# Altium project ESC30A.PrjPcb (part 2 of 3)
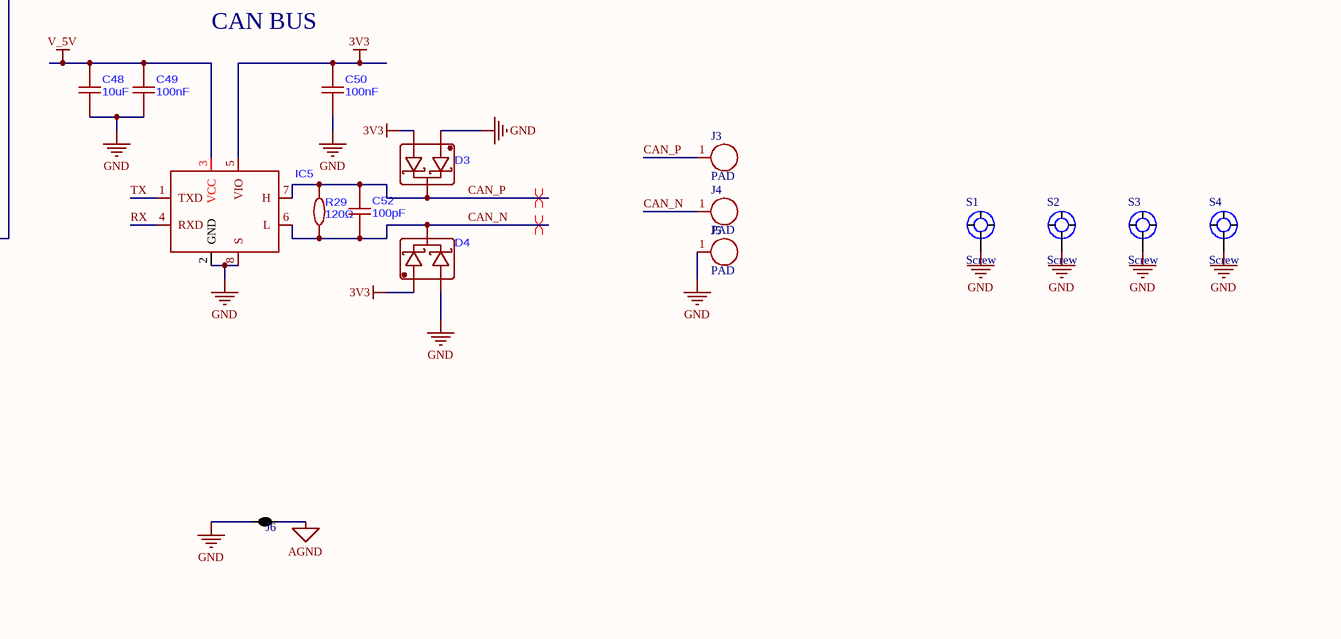
[diagram p4: ESC.SchDoc, bottom right]

## Sheet ESC.SchDoc (continued)
size A2; SheetNumber: 1; SheetTotal: 1; SPICEModelCacheXTDNQIYX: <root> / <DocumentId>XTDNQIYX</DocumentId> / <CacheFrame Number="0"> / <Model Name="smcj54a" Kind="CKT"> / <Text>*produced by Vishay General Semiconductor Taiwan / *Allen Su, 2015/12/24 / *   PSPICE / *                    anode     cathode / * Reverse direction: node 9 &lt;- node 2 / .SUBCKT smcj54a 9 2 / DF 9 90 DFMOD / .MODEL DFMOD D N = 2 IS = 1E-009 RS = 0.0184853 / + EG = 1.11 XTI = 3 / + CJO = 1.606E-009 VJ = 1.68538 M = 0.42 FC = 0.5 / + TT = 1E-008 T_MEASURED = 25 / * Leakage / RL 9 90 RLMOD 5.4E+007 / .MODEL RLMOD RES TC1 = 0 TC2 = 0 T_MEASURED = 25 / * Breakdown / RBD 90 4 1.392 / EBD 4 3 10 20 1 / DBD 3 9 DBDMOD / .MODEL DBDMOD D IS = 1E-015 N = 0.5 T_MEASURED = 25 T_ABS = 25 / IBVC 0 10 0.001 / RBVC 10 0 RBVCMOD 63150 / .MODEL RBVCMOD RES TC1 = 0 T_MEASURED = 25 / RBDX 20 23 1.392 / DBVC 23 0 DBDMOD / IBVD 0 20 0.001 / L1 90 2 1E-015 / .ENDS</Text> / </Model> / <Model Name="d_d1" Kind="MDL"> / <Text>*$ / .MODEL D_D1 D( IS=1e-15 TT=10p Rs=0.05 N=.1  VJ=10m)</Text> / </Model> / <Model Name="buf_delay_basic_gen" Kind="CKT"> / <Text>*$ / .SUBCKT BUF_DELAY_BASIC_GEN A  Y PARAMS: VDD=1 VSS=0 VTHRESH=0.5 DELAY = 10n / E_ABMGATE1    YINT1 0 VALUE {{IF(V(A) &gt; {VTHRESH} , / + {VDD},{VSS})}} / RINT YINT1 YINT2 1 / CINT YINT2 0 {DELAY*1.3} / E_ABMGATE2    YINT3 0 VALUE {{IF(V(YINT2) &gt; {VTHRESH} , / + {VDD},{VSS})}} / RINT2 YINT3 Y 1 / CINT2 Y 0 1n / .ENDS BUF_DELAY_BASIC_GEN</Text> / </Model> / <Model Name="and2_basic_gen" Kind="CKT"> / <Text>*$ / .SUBCKT AND2_BASIC_GEN A B Y PARAMS: VDD=1 VSS=0 VTHRESH=0.5 / E_ABMGATE    YINT 0 VALUE {{IF(V(A) &gt; {VTHRESH}  &amp; / + V(B) &gt; {VTHRESH},{VDD},{VSS})}} / RINT YINT Y 1 / CINT Y 0 1n / .ENDS AND2_BASIC_GEN</Text> / </Model> / <Model Name="oscillator_rt_sync_u100_h13" Kind="CKT"> / <Text>*$ / .subckt Oscillator_RT_SYNC_U100_H13 1 2 3 4 / H_U100_H13         3 4 VH_U100_H13 -1 / VH_U100_H13         1 2 0V / .ends Oscillator_RT_SYNC_U100_H13</Text> / </Model> / <Model Name="or2_basic_gen" Kind="CKT"> / <Text>*$ / .SUBCKT OR2_BASIC_GEN A B Y PARAMS: VDD=1 VSS=0 VTHRESH=0.5 / E_ABMGATE    YINT 0 VALUE {{IF(V(A) &gt; {VTHRESH}  | / + V(B) &gt; {VTHRESH},{VDD},{VSS})}} / RINT YINT Y 1 / CINT Y 0 1n / .ENDS OR2_BASIC_GEN</Text> / </Model> / <Model Name="inv_basic_gen" Kind="CKT"> / <Text>*$ / .SUBCKT INV_BASIC_GEN A  Y PARAMS: VDD=1 VSS=0 VTHRESH=0.5 / E_ABMGATE    YINT 0 VALUE {{IF(V(A) &gt; {VTHRESH} , / + {VSS},{VDD})}} / RINT YINT Y 1 / CINT Y 0 1n / .ENDS INV_BASIC_GEN</Text> / </Model> / <Model Name="oscillator_rt_sync_u100_s60" Kind="CKT"> / <Text>*$ / .subckt Oscillator_RT_SYNC_U100_S60 1 2 3 4 / S_U100_S60         3 4 1 2 _U100_S60 / RS_U100_S60         1 2 1G / .MODEL         _U100_S60 VSWITCH Roff=100e6 Ron=1u Voff=0.2 Von=0.8 / .ends Oscillator_RT_SYNC_U100_S60</Text> / </Model> / <Model Name="comp_basic_gen" Kind="CKT"> / <Text>*$ / .SUBCKT COMP_BASIC_GEN INP INM Y PARAMS: VDD=1 VSS=0 VTHRESH=0.5 / E_ABM Yint 0 VALUE {IF (V(INP) &gt; / + V(INM), {VDD},{VSS})} / R1 Yint Y 1 / C1 Y 0 1n / .ENDS COMP_BASIC_GEN</Text> / </Model> / <Model Name="d_d2" Kind="MDL"> / <Text>*$ / .MODEL D_D2 D( IS=1e-15 TT=10p Rs=0.05 N=1m  VJ=10m)</Text> / </Model> / <Model Name="comphys_basic_gen" Kind="CKT"> / <Text>*$ / .SUBCKT COMPHYS_BASIC_GEN INP INM HYS OUT PARAMS: VDD=1 VSS=0 VTHRESH=0.5 / EIN INP1 INM1 INP INM 1 / EHYS INP1 INP2 VALUE { IF( V(1) &gt; {VTHRESH},-V(HYS),0) } / EOUT OUT 0 VALUE { IF( V(INP2)&gt;V(INM1), {VDD} ,{VSS}) } / R1 OUT 1 1 / C1 1 0 1n / RINP1 INP1 0 1K / .ENDS COMPHYS_BASIC_GEN</Text> / </Model> / <Model Name="and4_basic_gen" Kind="CKT"> / <Text>*$ / .SUBCKT AND4_BASIC_GEN A B C D Y PARAMS: VDD=1 VSS=0 VTHRESH=0.5 / E_ABMGATE    YINT 0 VALUE {{IF(V(A) &gt; {VTHRESH}  &amp; / + V(B) &gt; {VTHRESH} &amp; / + V(C) &gt; {VTHRESH} &amp; / + V(D) &gt; {VTHRESH},{VDD},{VSS})}} / RINT YINT Y 1 / CINT Y 0 1n / .ENDS AND4_BASIC_GEN</Text> / </Model> / <Model Name="oscillator_rt_sync_u100_s59" Kind="CKT"> / <Text>*$ / .subckt Oscillator_RT_SYNC_U100_S59 1 2 3 4 / S_U100_S59         3 4 1 2 _U100_S59 / RS_U100_S59         1 2 1G / .MODEL         _U100_S59 VSWITCH Roff=100e6 Ron=1m Voff=0.4 Von=0.5 / .ends Oscillator_RT_SYNC_U100_S59</Text> / </Model> / <Model Name="driver_u8_s35" Kind="CKT"> / <Text>*$ / .subckt Driver_U8_S35 1 2 3 4 / S_U8_S35         3 4 1 2 _U8_S35 / RS_U8_S35         1 2 1G / .MODEL         _U8_S35 VSWITCH Roff=1000e6 Ron=15 Voff=0.2 Von=0.8 / .ends Driver_U8_S35</Text> / </Model> / <Model Name="driver_u8_s31" Kind="CKT"> / <Text>*$ / .subckt Driver_U8_S31 1 2 3 4 / S_U8_S31         3 4 1 2 _U8_S31 / RS_U8_S31         1 2 1G / .MODEL         _U8_S31 VSWITCH Roff=1000e6 Ron=155m Voff=1.0 Von=1.2 / .ends Driver_U8_S31</Text> / </Model> / <Model Name="driver_u8_s37" Kind="CKT"> / <Text>*$ / .subckt Driver_U8_S37 1 2 3 4 / S_U8_S37         3 4 1 2 _U8_S37 / RS_U8_S37         1 2 1G / .MODEL         _U8_S37 VSWITCH Roff=1e9 Ron=1m Voff=0.2V Von=0.8V / .ends Driver_U8_S37</Text> / </Model> / <Model Name="driver_u8_s5" Kind="CKT"> / <Text>*$ / .subckt Driver_U8_S5 1 2 3 4 / S_U8_S5         3 4 1 2 _U8_S5 / RS_U8_S5         1 2 1G / .MODEL         _U8_S5 VSWITCH Roff=1e9 Ron=2 Voff=0.2 Von=0.8 / .ends Driver_U8_S5</Text> / </Model> / <Model Name="d_d3" Kind="MDL"> / <Text>*$ / .MODEL D_D3 D( IS=1e-15 TT=10p Rs=0.01 N=1m  VJ=10m)</Text> / </Model> / <Model Name="driver_u8_h2" Kind="CKT"> / <Text>*$ / .subckt Driver_U8_H2 1 2 3 4 / H_U8_H2         3 4 VH_U8_H2 1 / VH_U8_H2         1 2 0V / .ends Driver_U8_H2</Text> / </Model> / <Model Name="driver_u8_s4" Kind="CKT"> / <Text>*$ / .subckt Driver_U8_S4 1 2 3 4 / S_U8_S4         3 4 1 2 _U8_S4 / RS_U8_S4         1 2 1G / .MODEL         _U8_S4 VSWITCH Roff=1e9 Ron=1.0 Voff=0.2 Von=0.8 / .ends Driver_U8_S4</Text> / </Model> / <Model Name="d_d" Kind="CKT"> / <Text>*$ / .subckt d_d 1 2 / d1 1 2 dd1 / .model dd1 d / + is=1e-015 / + tt=1e-011 / + rs=0.05 / + n=0.1 / .ends d_d</Text> / </Model> / <Model Name="or3_basic_gen" Kind="CKT"> / <Text>*$ / .SUBCKT OR3_BASIC_GEN A B C Y PARAMS: VDD=1 VSS=0 VTHRESH=0.5 / E_ABMGATE    YINT 0 VALUE {{IF(V(A) &gt; {VTHRESH}  | / + V(B) &gt; {VTHRESH} | / + V(C) &gt; {VTHRESH},{VDD},{VSS})}} / RINT YINT Y 1 / CINT Y 0 1n / .ENDS OR3_BASIC_GEN</Text> / </Model> / <Model Name="inv_delay_basic_gen" Kind="CKT"> / <Text>*$ / .SUBCKT INV_DELAY_BASIC_GEN A  Y PARAMS: VDD=1 VSS=0 VTHRESH=0.5 DELAY = 10n / E_ABMGATE1    YINT1 0 VALUE {{IF(V(A) &gt; {VTHRESH} , / + {VDD},{VSS})}} / RINT YINT1 YINT2 1 / CINT YINT2 0 {DELAY*1.3} / E_ABMGATE2    YINT3 0 VALUE {{IF(V(YINT2) &gt; {VTHRESH} , / + {VSS},{VDD})}} / RINT2 YINT3 Y 1 / CINT2 Y 0 1n / .ENDS INV_DELAY_BASIC_GEN</Text> / </Model> / <Model Name="ss2gm" Kind="CKT"> / <Text>*$ / .SUBCKT ss2gm SS GM / EPOLY GM 0 TABLE {V(SS)} = (0.5,10.9u) (0.55,12.4u) (0.6,17.5u) (0.65,23.7u) (0.7,27.1u) / + (0.75,28.5u)(.8,29.1u)(.85,29.3u) (.9,29.4u) (.95,29.6u) (1,30u) / .ENDS ss2gm</Text> / </Model> / <Model Name="erroramp_u5_s5" Kind="CKT"> / <Text>*$ / .subckt ErrorAmp_U5_S5 1 2 3 4 / S_U5_S5         3 4 1 2 _U5_S5 / RS_U5_S5         1 2 1G / .MODEL         _U5_S5 VSWITCH Roff=1e10 Ron=1m Voff=0.1 Von=0.9 / .ends ErrorAmp_U5_S5</Text> / </Model> / <Model Name="and3_basic_gen" Kind="CKT"> / <Text>*$ / .SUBCKT AND3_BASIC_GEN A B C Y PARAMS: VDD=1 VSS=0 VTHRESH=0.5 / E_ABMGATE    YINT 0 VALUE {{IF(V(A) &gt; {VTHRESH}  &amp; / + V(B) &gt; {VTHRESH} &amp; / + V(C) &gt; {VTHRESH},{VDD},{VSS})}} / RINT YINT Y 1 / CINT Y 0 1n / .ENDS AND3_BASIC_GEN</Text> / </Model> / <Model Name="buf_basic_gen" Kind="CKT"> / <Text>*$ / .SUBCKT BUF_BASIC_GEN A  Y PARAMS: VDD=1 VSS=0 VTHRESH=0.5 / E_ABMGATE    YINT 0 VALUE {{IF(V(A) &gt; {VTHRESH} , / + {VDD},{VSS})}} / RINT YINT Y 1 / CINT Y 0 1n / .ENDS BUF_BASIC_GEN</Text> / </Model> / <Model Name="srlatchrhp_basic_gen" Kind="CKT"> / <Text>*$ / .SUBCKT SRLATCHRHP_BASIC_GEN S R Q QB PARAMS: VDD=1 VSS=0 VTHRESH=0.5 / GQ 0 Qint VALUE = {IF(V(R) &gt; {VTHRESH},-5,IF(V(S)&gt;{VTHRESH},5, 0))} / CQint Qint 0 1n / RQint Qint 0 1000MEG / D_D10 Qint MY5 D_D1 / V1 MY5 0 {VDD} / D_D11 MYVSS Qint D_D1 / V2 MYVSS 0 {VSS} / EQ Qqq 0 Qint 0 1 / X3 Qqq Qqqd1 BUF_BASIC_GEN PARAMS: VDD={VDD} VSS={VSS} VTHRESH={VTHRESH} / RQq Qqqd1 Q 1 / EQb Qbr 0 VALUE = {IF( V(Q) &gt; {VTHRESH}, {VSS},{VDD})} / RQb Qbr QB 1 / Cdummy1 Q 0 1n / Cdummy2 QB 0 1n / .IC V(Qint) {VSS} / .ENDS SRLATCHRHP_BASIC_GEN</Text> / <Dependency>0\d_d1</Dependency> / <Dependency>0\buf_basic_gen</Dependency> / </Model> / <Model Name="lmr16030s_trans" Kind="CKT"> / <Text>*$ / * LMR16030 / ***************************************************************************** / * (C) Copyright 2016 Texas Instruments Incorporated. All rights reserved. / ***************************************************************************** / ** This model is designed as an aid for customers of Texas Instruments. / ** TI and its licensors and suppliers make no warranties, either expressed / ** or implied, with respect to this model, including the warranties of / ** merchantability or fitness for a particular purpose.  The model is / ** provided solely on an "as is" basis.  The entire risk as to its quality / ** and performance is with the customer / ***************************************************************************** / * / * This model is subject to change without notice. Texas Instruments / * Incorporated is not responsible for updating this model. / * / ***************************************************************************** / * / ** Released by: WEBENCH Design Center, Texas Instruments Inc. / * Part: LMR16030S / * Date: 06JUN2016 / * Model Type:  TRANSIENT / * Simulator: PSPICE / * Simulator Version: 16.2.0.p001 / * EVM Order Number: LMR16030PEVM / * EVM Users Guide: NA / * Datasheet: SNVSAH9A â€“DECEMBER 2015â€“REVISED MAY 2016 / * / * Model Version: Final 1.00 / * / ***************************************************************************** / * / * Updates: / * / * Final 1.00 / * Release to Web. / * / ***************************************************************************** / * / * Model Usage Notes: / * / * 1. All the features mentioned in the datasheet have been modelled except / *      a. Thermal behaviour / *      b. Operating quiescent current / *      c. Shutdown supply current / *      d. PLL lock in time / *      e. Sync feature works with fixed frequency external clock. If the clock frequency / *		  varies, switching frequency locks with minimum frequency of external clock. / * / ***************************************************************************** / .SUBCKT LMR16030S_TRANS BOOT EN FB GND RT/SYNC SS SW VIN PAD PARAMS: SS=0 / R_U100_R339         GND RT/SYNC  500meg / V_U100_V105         U100_N17467204 0 4.2Vdc / E_U100_ABM54         U100_N17466738 0 VALUE { / + {IF(V(U100_N17466711)&lt;0.1875,0.125*V(U100_N17466470), / + (IF(V(U100_N17466711)&lt;0.375,0.25*V(U100_N17466470), / + (IF(V(U100_N17466711)&lt;0.5625,0.5*V(U100_N17466470),V(U100_N17466470))))))} / +  } / D_U100_D78         U100_N17475790 U100_N17476944 D_D1 / E_U100_ABM51         U100_N17465902 0 VALUE { / +  if(V(U100_SYNC_DET)&gt;0.5,0,(((-V(I_RT)*1000) / + **(1/1.088))*90.52748*1u*1.015))   } / V_U100_V106         U100_N17503167 0 1 / X_U100_U725         U100_N17466245 U100_N17467423 U100_N17465899 AND2_BASIC_GEN / +  PARAMS: VDD=1 VSS=0 VTHRESH=500E-3 / X_U100_U183         SDWN U100_N17466875 U100_N17466883 OR2_BASIC_GEN PARAMS: / +  VDD=1 VSS=0 VTHRESH=500E-3 / E_U100_E56         U100_N17466711 0 FB GND 1 / X_U100_S60    U100_RAMP_CNTRL 0 U100_VRAMP 0 Oscillator_RT_SYNC_U100_S60 / X_U100_U600         RAMPIN U100_N17503167 MUXCLK COMP_BASIC_GEN PARAMS: VDD=1 / +  VSS=0 VTHRESH=0.5 / E_U100_E58         U100_N17466245 0 U100_N17475790 0 1 / X_U100_U730         U100_N17466245 U100_N17467414 INV_BASIC_GEN PARAMS: VDD=1 / +  VSS=0 VTHRESH=500E-3 / C_U100_C113         RAMPIN 0  5p IC=0 / G_U100_ABMII15         U100_N17466947 RAMPIN VALUE { V(U100_N17466738)    } / E_U100_ABM52         U100_N17465891 0 VALUE { IF(V(U100_SYNC_DET)&gt;.5,0,1)    } / X_U100_U186         U100_CLK_DET SDWN U100_RAMP_CNTRL OR2_BASIC_GEN PARAMS: / +  VDD=1 VSS=0 VTHRESH=500E-3 / V_U100_V104         U100_N17466947 0 5 / E_U100_ABM59         U100_SYNC_DET 0 VALUE { IF((V(U100_RT_SYNC_CHCK)&lt;0.98 &amp; / +  V(U100_RT_SYNC_CHCK)&gt;1.02),1,0)    } / E_U100_E53         U100_N17466093 0 U100_VRAMP U100_SYNC_FREQ_CHCK 1000000 / I_U100_I17         U100_N17467204 U100_VRAMP DC 1Adc / R_U100_R343         0 RT/SYNC  500MEG / V_U100_V103         U100_N17466912 U100_N17467201 0 / E_U100_ABM55         U100_N17476944 0 VALUE { IF(V(U100_SYNC_LVL_CHCK)&lt;0.5,0,1) / +     } / C_U100_C179         0 U100_VRAMP  1u IC=0 / E_U100_ABM53         U100_SYNC_FREQ_OK 0 VALUE { / +  IF((V(U100_SYNC_FREQ_CHCK)&gt;424.78m &amp; V(U100_SYNC_FREQ_CHCK)&lt;3.99),1,0)    } / C_U100_C112         0 U100_SYNC_FREQ_CHCK  1n  TC=0,0 / R_U100_R344         I_RT 0  1 / X_U100_U734         U100_N17467414 U100_N17467423 BUF_DELAY_BASIC_GEN PARAMS: / +  VDD=1 VSS=0 VTHRESH=0.5 DELAY=10n / D_U100_D73         U100_VRAMP U100_N17467204 D_D1 / C_U100_C177         0 U100_SYNC_EN  1n IC=0 TC=0,0 / X_U100_H13    RT/SYNC U100_N17466912 I_RT 0 Oscillator_RT_SYNC_U100_H13 / R_U100_R341         U100_SYNC_FREQ_OK U100_SYNC_EN  1 TC=0,0 / C_U100_C183         0 U100_N17475790  1n  TC=0,0 / D_U100_D77         U100_N17466093 U100_SYNC_FREQ_CHCK D_D2 / E_U100_E57         U100_N17466532 GND U100_N17465891 0 1 / E_U100_E55         U100_RT_SYNC_CHCK 0 RT/SYNC GND 1 / D_U100_D74         RAMPIN U100_N17466947 D_D1 / R_U100_R347         U100_N17476944 U100_N17475790  42 TC=0,0 / X_U100_U724         U100_RT_SYNC_CHCK U100_N17466179 U100_N17466150 / +  U100_SYNC_LVL_CHCK COMPHYS_BASIC_GEN PARAMS: VDD=1 VSS=0 VTHRESH=0.5 / E_U100_ABM56         U100_N17466470 0 VALUE { / +  IF(V(U100_SYNC_EN)&gt;0.5,V(U100_N17467666),V(U100_N17465902))    } / V_U100_V99         U100_N17466150 0 1.198 / E_U100_ABM57         U100_N17467666 0 VALUE { 5p/V(U100_FREQ_TO_TIME)    } / X_U100_U735         MUXCLK U100_N17466875 BUF_DELAY_BASIC_GEN PARAMS: VDD=1 / +  VSS=0 VTHRESH=0.5 DELAY=20n / R_U100_R340         U100_N17467201 U100_N17466532  1 / V_U100_V100         U100_N17466179 0 1.699 / X_U100_S59    U100_N17466883 0 RAMPIN 0 Oscillator_RT_SYNC_U100_S59 / E_U100_ABM58         U100_CLK_DET 0 VALUE { IF(V(U100_N17465899)&lt;0.5,0,1)    } / E_U100_ABM190         U100_FREQ_TO_TIME 0 VALUE { / +  V(U100_SYNC_FREQ_CHCK)*.000001    } / X_U8_S35    U8_BOOT_SW_ON 0 BOOT U8_N16795601 Driver_U8_S35 / D_U8_D14         SW U8_N16770032 D_D1 / X_U8_U616         U8_LDRV ENAB U8_BOOT_ON U8_SDWN_N U8_BOOT_SW_ON / +  AND4_BASIC_GEN PARAMS: VDD=1 VSS=0 VTHRESH=500E-3 / X_U8_U623         U8_N16769726 PWM_FINAL U8_HDRVIN AND2_BASIC_GEN PARAMS: VDD=1 / +  VSS=0 VTHRESH=500E-3 / R_U8_R250         U8_HDRVIN U8_N16829827  14.43 / E_U8_ABM3         U8_N168201641 0 VALUE { ((V(U8_OUT) *-100m)+ 3.3)    } / X_U8_U606         SDWN U8_SDWN_N INV_BASIC_GEN PARAMS: VDD=1 VSS=0 / +  VTHRESH=500E-3 / X_U8_S31    HDRV SW U8_N16770032 SW Driver_U8_S31 / C_U8_C144         0 U8_N16829827  1n / X_U8_U6         U8_N16820133 U8_N16820119 U8_OUT COMP_BASIC_GEN PARAMS: VDD=1 / +  VSS=0 VTHRESH=0.5 / X_U8_U617         U8_LDRV U8_N16771112 U8_N16825880 AND2_BASIC_GEN PARAMS: / +  VDD=1 VSS=0 VTHRESH=500E-3 / X_U8_U624         U8_HDRVIN U8_N16829827 U8_N16826034 AND2_BASIC_GEN PARAMS: / +  VDD=1 VSS=0 VTHRESH=500E-3 / R_U8_R4         U8_N168201641 U8_N16820119  1 / E_U8_ABM168         U8_N16820158 0 VALUE { {IF((V(BOOT) - V(SW)) &lt; 3.2,0,1)} / +  } / X_U8_U603         U8_OUT U8_BOOT_ON INV_BASIC_GEN PARAMS: VDD=1 VSS=0 / +  VTHRESH=500E-3 / X_U8_U625         SDWN U8_N16769726 INV_BASIC_GEN PARAMS: VDD=1 VSS=0 / +  VTHRESH=500E-3 / X_U8_S37    U8_BOOT_SW_ON 0 U8_N16797590 GND Driver_U8_S37 / R_U8_R247         U8_N16820158 BOOT_UVLO  1 / R_U8_R248         U8_N16826034 U8_N16826193  1 TC=0,0 / C_U8_C142         0 U8_N16826193  1.443n  TC=0,0 / C_U8_C4         0 U8_N16820119  1n / R_U8_R251         U8_LDRV U8_N16771112  14.43 / C_U8_C141         0 BOOT_UVLO  1n / X_U8_S5    U8_N16826193 0 BOOT HDRV Driver_U8_S5 / D_U8_D16         SW U8_N16797590 D_D3 / E_U8_ABM170         U8_N16820133 0 VALUE { V(BOOT) - V(SW)    } / C_U8_C145         0 U8_N16771112  1n / R_U8_R246         GND BOOT  10MEG / C_U8_C143         0 U8_N16771034  1.443n  TC=0,0 / D_U8_D15         VIN U8_N16795601 D_D1 / X_U8_H2    VIN U8_N16770032 ISW 0 Driver_U8_H2 / R_U8_R249         U8_N16825880 U8_N16771034  1 TC=0,0 / X_U8_S4    U8_N16771034 0 HDRV SW Driver_U8_S4 / X_U8_U621         U8_HDRVIN U8_LDRV INV_BASIC_GEN PARAMS: VDD=1 VSS=0 / +  VTHRESH=500E-3 / V_U11_V67         U11_N16734547 GND 1.2 / X_U11_U604         ENAB U11_N16734487 INV_BASIC_GEN PARAMS: VDD=1 VSS=0 / +  VTHRESH=500E-3 / X_U11_U605         U11_N16734651 UVLO INV_BASIC_GEN PARAMS: VDD=1 VSS=0 / +  VTHRESH=500E-3 / V_U11_V65         U11_N167343550 0 0.285 / I_U11_I1         0 EN DC 1u / X_U11_U615         VIN U11_N16734493 U11_N167343550 U11_N16734651 / +  COMPHYS_BASIC_GEN PARAMS: VDD=1 VSS=0 VTHRESH=0.5 / R_U11_R288         EN 0  10MEG / V_U11_V64         U11_N16734493 GND 4.2 / X_U11_U616         EN U11_N16734547 ENAB COMP_BASIC_GEN PARAMS: VDD=1 VSS=0 / +  VTHRESH=0.5 / X_U11_U601         U11_N16734487 UVLO SDWN OR2_BASIC_GEN PARAMS: VDD=1 VSS=0 / +  VTHRESH=500E-3 / G_U11_ABMII1         0 EN VALUE { if(V(ENAB)&gt;0.5,3.6u,0)    } / X_U7_U620         U7_N16489522 U7_N16489700 d_d PARAMS: / X_U7_U823         U7_N16497188 PWM_CLK U7_N16489522 AND2_BASIC_GEN PARAMS: / +  VDD=1 VSS=0 VTHRESH=500E-3 / X_U7_U824         U7_N16489522 U7_N16489700 PWM_CLK PWM_FINAL OR3_BASIC_GEN / +  PARAMS: VDD=1 VSS=0 VTHRESH=500E-3 / R_U7_R272         U7_N16489522 U7_N16489700  75 / X_U7_U822         PWM_CLK U7_N16497188 INV_DELAY_BASIC_GEN PARAMS: VDD=1 VSS=0 / +  VTHRESH=0.5 DELAY=15n / C_U7_C172         0 U7_N16489700  1.443n / R_U5_R12         U5_N16790193 COMP  360k / C_U5_C5         0 COMP  50f / R_U5_R4         0 COMP  250Meg / E_U5_E9         U5_N16790376 0 FB GND 1 / C_U5_C10         0 U5_N16790193  60p / E_U5_ABM8         U5_N16790300 0 VALUE { {IF(V(COMP) &gt; 2.2,1,0)}    } / X_U5_U615         SS_INT U5_N16790318 SS2GM / C_U5_C9         0 OL  1n / X_U5_U614         U5_N16790300 U5_N16790265 U5_N16790290 AND2_BASIC_GEN PARAMS: / +  VDD=1 VSS=0 VTHRESH=500E-3 / G_U5_ABM2I1         0 COMP VALUE { {LIMIT((V(VREF) - V(U5_N16790376))*V(U5_GM), / +  -3u,3u)}    } / X_U5_U603         SDWN U5_N16790265 INV_BASIC_GEN PARAMS: VDD=1 VSS=0 / +  VTHRESH=500E-3 / V_U5_V5         U5_N16790259 0 0.39 / R_U5_R11         U5_N16790290 OL  1 / C_U5_C166         0 U5_GM  1n / X_U5_S5    UVLO 0 COMP 0 ErrorAmp_U5_S5 / D_U5_D15         U5_N16790259 COMP D_D2 / R_U5_R290         U5_N16790318 U5_GM  1 / V_U5_V6         U5_N16790256 0 2.85 / D_U5_D16         COMP U5_N16790256 D_D2 / D_U4_D77         GND SS D_D2 / R_U4_R15         U4_N167408121 U4_N16740842  1 / G_U4_ABMII2         SS GND VALUE { {IF(V(U4_N16740842) &gt; 0.5,400u,0)}    } / E_U4_ABM178         VREF 0 VALUE { IF(V(SS_INT) &lt; 0.75, V(SS_INT),0.75)    } / C_U4_C15         0 U4_N16740842  1n / D_U4_D64         SS U4_N16740968 D_D1 / X_U4_U1         SDWN U4_N16741042 INV_BASIC_GEN PARAMS: VDD=1 VSS=0 / +  VTHRESH=500E-3 / V_U4_V71         U4_N16740968 GND 1.2Vdc / V_U4_V70         U4_N16741142 GND 2.85 / E_U4_E1         SS_INT 0 SS GND 1 / G_U4_ABMII1         U4_N16741142 SS VALUE { {IF(V(U4_N16741042) &gt; 0.5,3u,0)} / +  } / D_U4_D62         SS U4_N16741142 D_D1 / E_U4_ABM181         U4_N167408121 0 VALUE { {IF(V(SDWN) &gt; 0.5 | (V(OL) &gt; 0.5 ), / +  1,0)}    } / X_U6_U600         U6_ICTRL U6_ISWF U6_COM_PULSE COMP_BASIC_GEN PARAMS: VDD=1 / +  VSS=0 VTHRESH=0.5 / E_U6_ABM166         U6_N16795665 0 VALUE { {((V(COMP) /260k)  - 1.5u)*(17/6)} / +   } / E_U6_ABM151         U6_N16796154 0 VALUE { {IF(V(PWM_FINAL) &gt; 0.5, 1,0)}    } / D_U6_D58         U6_N16796158 U6_N16796154 D_D1 / E_U6_ABM149         U6_VRAMP 0 VALUE { V(RAMPIN)*0.0049897m    } / X_U6_U616         U6_N16796183 U6_N16799371 U6_N168023163 U6_OVTP / +  COMPHYS_BASIC_GEN PARAMS: VDD=1 VSS=0 VTHRESH=0.5 / E_U6_ABM152         U6_ISWF 0 VALUE { {IF(V(U6_N16796158) &gt; 0.5, / + V(ISW),0)}   } / E_U6_ABM168         U6_N16796216 0 VALUE { LIMIT(((V(U6_N16795665) - / +  V(U6_VRAMP)) * 10) / + ,6.369863u,99.749545u)   } / V_U6_V80         U6_N16795752 0 0.41 / E_U6_E9         U6_N16799371 0 FB GND 1 / V_U6_V79         U6_N16796183 0 .8025 / X_U6_U602         U6_COM_PULSE BOOT_UVLO U6_OVTP U6_N16795766 AND3_BASIC_GEN / +  PARAMS: VDD=1 VSS=0 VTHRESH=500E-3 / C_U6_C136         0 U6_ICTRL  1n / X_U6_U615         COMP U6_N16795752 U6_N16795706 U6_N16795759 COMPHYS_BASIC_GEN / +  PARAMS: VDD=1 VSS=0 VTHRESH=0.5 / R_U6_R240         U6_N16818592 U6_ICTRL  1 / X_U6_U625         U6_N16817255 U6_N16817360 INV_BASIC_GEN PARAMS: VDD=1 VSS=0 / +  VTHRESH=500E-3 / R_U6_R255         U6_N16796154 U6_N16796158  14.4k / X_U6_U605         U6_N16795766 U6_N16795759 U6_N16817255 AND2_BASIC_GEN PARAMS: / +  VDD=1 VSS=0 VTHRESH=500E-3 / V_U6_V81         U6_N16795706 0 0.01 / V_U6_V82         U6_N168023163 0 15m / E_U6_ABM208         U6_N16818592 0 VALUE { (V(U6_N16796216) * 47.096774k)    } / C_U6_C146         0 U6_N16796158  5p / X_U6_U15         MUXCLK U6_N16817360 PWM_CLK N16817937 SRLATCHRHP_BASIC_GEN / +  PARAMS: VDD=1 VSS=0 VTHRESH=0.5 / .IC         V(SS )={{SS}*2.85} / .ENDS LMR16030S_TRANS</Text> / <Dependency>0\d_d1</Dependency> / <Dependency>0\buf_delay_basic_gen</Dependency> / <Dependency>0\and2_basic_gen</Dependency> / <Dependency>0\oscillator_rt_sync_u100_h13</Dependency> / <Dependency>0\or2_basic_gen</Dependency> / <Dependency>0\inv_basic_gen</Dependency> / <Dependency>0\oscillator_rt_sync_u100_s60</Dependency> / <Dependency>0\comp_basic_gen</Dependency> / <Dependency>0\d_d2</Dependency> / <Dependency>0\comphys_basic_gen</Dependency> / <Dependency>0\and4_basic_gen</Dependency> / <Dependency>0\oscillator_rt_sync_u100_s59</Dependency> / <Dependency>0\driver_u8_s35</Dependency> / <Dependency>0\driver_u8_s31</Dependency> / <Dependency>0\driver_u8_s37</Dependency> / <Dependency>0\driver_u8_s5</Dependency> / <Dependency>0\d_d3</Dependency> / <Dependency>0\driver_u8_h2</Dependency> / <Dependency>0\driver_u8_s4</Dependency> / <Dependency>0\d_d</Dependency> / <Dependency>0\or3_basic_gen</Dependency> / <Dependency>0\inv_delay_basic_gen</Dependency> / <Dependency>0\ss2gm</Dependency> / <Dependency>0\erroramp_u5_s5</Dependency> / <Dependency>0\and3_basic_gen</Dependency> / <Dependency>0\srlatchrhp_basic_gen</Dependency> / </Model> / <Model Name="dmbrs3100lt3" Kind="MDL"> / <Text>************************************** / *      Model Generated by MODPEX     * / *Copyright(c) Symmetry Design Systems* / *         All Rights Reserved        * / *    UNPUBLISHED LICENSED SOFTWARE   * / *   Contains Proprietary Information * / *      Which is The Property of      * / *     SYMMETRY OR ITS LICENSORS      * / *    Modeling services provided by   * / * Interface Technologies www.i-t.com * / ************************************** / .MODEL Dmbrs3100lt3 d / +IS=0.000218691 RS=0.0139624 N=2.73664 EG=0.845343 / +XTI=4.78882 BV=100 IBV=5e-05 CJO=4.45302e-10 / +VJ=0.4 M=0.480577 FC=0.5 TT=0 / +KF=0 AF=1</Text> / </Model> / <Model Name="bzt52c56" Kind="CKT"> / <Text>* SPICE model Zener diodes ***BZT52C56*** / * Use the symbol file ***bzt52c56.asy*** / * / * (c) Diotec Semiconductor AG / * www.diotec.com / * 2023-02-27 / * / ********************************************************* / * This model is for simulation purposes only. It does   * / * not replace reviewing of the data sheet nor real life * / * testing of the part inside the application.           * / ********************************************************* / * / .subckt BZT52C56  A  K  params: Vznom=56 Iztest=2m Vr=43 Ir=1u Rzj=180 Izmax=8m Cjo=12p / * Above values are an example for the ***BZT52C56***. Using the / * above symbol file allows for direct insertion of other values / * according to these data sheet parameters: / * / * Vznom		Nominal zener voltage at 25°C = (Vzmin+Vzmax)/2 / * Iztest	Test current for Vz / * Vr		Reverse voltage (minimum value) / * Ir		Reverse current / * Rzj		Dynamic resistance / * Izmax		Max zener current / * Cjo		Junction capacitance at 0V / Dbr  INT  K  Zbr / Df   A    K  Zf / Dbl  INT  A  DIObl / * Zener breakdown characteristic / .model  Zbr  D(Is={Ir/10} N=2.0 Rs={Rzj} Bv={Vznom*(1+(temp-25)*0.001)} Ibv={Iztest} Eg=1.11 Xti=3 M=.33 diss={Vznom*Izmax}) / * / * Forward characteristic / .model  Zf  D(Is=100E-9 N=2.0 Rs=37m Cjo={Cjo} Eg=1.11 Xti=3 M=.33 Tt=800n) / * / * Internal blocking diode / .model  DIObl  D(Ron=.1m) / .ends</Text> / </Model> / <Model Name="tph4r008qm_g0_00" Kind="CKT"> / <Text>* PSpice Unencrypted File / * / * This unencrypted file has been supplied by / * Toshiba Electronic Devices &amp; Storage Corporation / * that does not wish to publicize the technology / * used to implement this library. / * / * Permission is granted to use this file for / * simulations but not to reverse engineer its / * contents. / * When using Simulation Model, please be sure to / * visit "Simulation" page and re-confirm / * Restrictions on Usage, Limitations and others in / * "Cautions on Simulation Model" on Toshiba Electronic / * Devices &amp; Storage Corporation website. / * / ********************************************************************************* / * (C) Copyright 2021 Toshiba Electronic Devices &amp; Storage Corporation / * Date            : 23/03/2020 / * File Name       : TPH4R008QM_G0_00_PSpice_rev1.lib / * Part Number     : TPH4R008QM_G0_00 / * Parameter Rev.  : 1 / * Simulator       : PSpice (OrCAD 17.2) / * Model Call Name : TPH4R008QM_G0_00 / * TNOM            : 25 degree / * Pin Assign      : 1=Drain 2=Gate 3=Source / * / * Operation of this model has been verified only on the PSpice (OrCAD 17.2) / ********************************************************************************* / .SUBCKT TPH4R008QM_G0_00 1 2 3 / M0 1 22 3 3 smsmosfet / + L=1e-06 / + W=4 / + AD=4E-006 / + AS=4E-006 / + PD=8 / + PS=8 / D0 3 1 DDS1 / D1 3 1 DDS2 / D2 2 10 DGS1 / D3 3 10 DGS2 / R2 10 2 1E+009 / R3 10 3 1E+009 / RG 2 22 1.6 / .MODEL smsmosfet NMOS / + LEVEL=7 / + MOBMOD=1 / + CAPMOD=3 / + NOIMOD=1 / + TOX=2.5e-08 / + XJ=1.5E-007 / + NCH=1.7E+017 / + NGATE=0 / + RSH=0 / + TNOM=25 / + VTH0=3.725 / + VOFF=-0.18 / + NFACTOR=2.6 / + U0=2800 / + K1=0.5 / + K2=0 / + K3=80 / + K3B=0 / + W0=2.5E-006 / + NLX=1.74E-007 / + DVT0=2.2 / + DVT1=0.53 / + DVT2=-0.032 / + DVT0W=0 / + DVT1W=5.3E+006 / + DVT2W=-0.032 / + DWG=0 / + DWB=0 / + UA=9.0124e-09 / + UB=5.87E-019 / + UC=-4.65E-011 / + VSAT=27710.317 / + A0=6.1022 / + AGS=1.6111 / + B0=0 / + B1=0 / + KETA=-0.047 / + A1=0 / + A2=1 / + DELTA=0.066202 / + RDSW=9100 / + PRWG=0 / + PRWB=0 / + WR=1 / + CDSC=2.4E-004 / + CDSCD=0 / + CDSCB=0 / + CIT=0 / + ETA0=0.08 / + ETAB=-0.07 / + DSUB=0.56 / + PCLM=1e-05 / + PDIBLC1=0.10461 / + PDIBLC2=0.0028736 / + PDIBLCB=0 / + DROUT=0.56 / + PSCBE1=4.24E+008 / + PSCBE2=1E-009 / + PVAG=0 / + ALPHA0=0 / + ALPHA1=0 / + BETA0=30 / + NJ=1 / + JS=2e-07 / + XPART=0 / + CGSO=4.8e-10 / + CGDO=9e-12 / + CGBO=0 / + CGDL=9e-10 / + CGSL=2e-10 / + CKAPPA=0.185 / + CF=0 / + CLC=1E-007 / + CLE=0.6 / + VOFFCV=0 / + NOFF=1 / + DLC=0 / + ACDE=1 / + MOIN=15 / + CJ=0 / + CJSW=1E-012 / + CJSWG=1E-012 / + PB=1 / + PBSW=1 / + PBSWG=1 / + MJ=0.5 / + MJSW=0.33 / + MJSWG=0.33 / + AF=1 / + EF=1 / + KF=0 / + UTE=-1.4 / + KT1=-1.2 / + KT1L=0 / + KT2=0.022 / + UA1=4.31E-009 / + UB1=-7.61E-018 / + UC1=-5.6E-011 / + AT=3.3E+004 / + PRT=20000 / + XTI=3 / + TCJ=0 / + TPB=0 / + TCJSW=0 / + TPBSW=0 / + TCJSWG=0 / + TPBSWG=0 / + DWC=1.09 / .MODEL DDS1 D / + TNOM=25 / + IS=9.9997e-10 / + RS=0.0010306 / + N=1.3377 / + CJO=2e-09 / + VJ=0.9 / + M=0.33 / + XTI=0 / + TT=3.45e-08 / + BV=80 / + IBV=0.01 / .MODEL DDS2 D / + TNOM=25 / + IS=9.9997e-10 / + RS=0.0010306 / + N=1.3377 / + CJO=1E-15 / + VJ=0.7 / + M=0.3 / + XTI=0 / + TT=3.45e-08 / .MODEL DGS1 D / + TNOM=25 / + IS=1E-015 / .MODEL DGS2 D / + TNOM=25 / + IS=1E-015 / .ENDS</Text> / </Model> / <Model Name="asymmetric_delay" Kind="CKT"> / <Text>*$ / .subckt asymmetric_delay inp  out params: rising_edge_delay=1 vthresh=0.5 / +  falling_edge_delay=1 vdd=1 vss=0 / $CDNENCSTART_ADV2 / 17f62b1fb318c25603aeb85644ae98a5d179ef807807791f6459efacb9d7ffc37a831b146dc0f06bb1ef275619162e6d8f7ad0dc708bf15ae1a1d5bd0ae623b2 / 852a7c4d572049b6c13db49bc921374b6e76258c2b690f268bc522ab3f4fcfe36c13dfd56ba1d1b7f75b773b5756148eba05a015ea75093e067145f82b6b1b3d / aa68021e27b00d80d47a43f080c8cbb6c31bf63f60850221a7ac1e46b19d611a14ce99fe5fc488c292605a68529c58a741df5705408475625a9630c1a16a85bd / 47ea048d17c01de1bcc798747111a25c4cf4561258974c4d5dde6a37f286d62ada520a0c48467aba1e600de95b58589515cd77e17fb31de06c9592b1f08e64d7 / 3805f1506485423753a4d858d1225a94b70c4285467156eeef951a190d9667302310153a23532af982540dd23c06ecb988541f163696fafdd3b10b26b5350bb0 / ab496babb2ededdca853278c9d478096757fa33c2cf8ffa204f31f3d28f957dbe2c9ceda8fd85820a8d8b827b73067b415cd77e17fb31de06c9592b1f08e64d7 / 3805f1506485423753a4d858d1225a94b70c4285467156eeef951a190d9667302310153a23532af982540dd23c06ecb988541f163696fafdd3b10b26b5350bb0 / 2cfce3f1c5c04eb02d3c2562271db406a498870d9483132f5f82e66698841dc5ea1af96ea6d6f635f68326cabbe00c0593bb08712cd477536525582a9fb16db0 / d96db7fdaf30ed9fe663d425b0de8cff745b30bb0c283a6a24e839ee88af152ef12dcfaccb5a68da95409924f2ea06ddcccd120e863a1219995e828679c1d2a5 / 6c70be1230ea2c9a2eb2c263ebc8708e928096affc40f8de23399fb0df54ded4078598f0ac1d4efd587858f61867f435f132d98bf420851170526b91d588170a / 5663a6232c34cf30fecfc028bcfbc009d956e7ed474e05d455c479664cca0ccfc31bf63f60850221a7ac1e46b19d611afe998c77357134d60b1d390bc57840e1 / 484d07025d152275911a97e1a0d641951dfb6a3ff903e457d5ae0b753d3575bfea1af96ea6d6f635f68326cabbe00c0593bb08712cd477536525582a9fb16db0 / e64cc5d969936bf11d0e5bdcd0d1a9b88cb98fa6d0e41f76432223f1946772932a2b11ce823d2caa87e8c7f4660ec402cccd120e863a1219995e828679c1d2a5 / dfc49654ddb59fbd898875675688a7cc24562f9d38243c05b32c78bb988c2a25ba4a2336c155842202ef4231ea29571cbd3fc92fd352af3f286274893b0ee52b / 033d30d338f2c62479e81865c160ee0db8e0b703994018cc955726fb9ea735eeb70c4285467156eeef951a190d966730aff65a094ddc3f21ec19b3ab002f9366 / 6958742b3469e9d2d7ecf77a650a931cea1af96ea6d6f635f68326cabbe00c0582efc3103447d6c6b2120f40908dbf452c257e0a60c0cb32dcc1fc097092974a / 1f5d2547cc66d938dd5738b7fc655ffdb70c4285467156eeef951a190d9667302310153a23532af982540dd23c06ecb988541f163696fafdd3b10b26b5350bb0 / 17a31ffe77583c5ec02c31b30a3bab0bb70c4285467156eeef951a190d9667302310153a23532af982540dd23c06ecb988541f163696fafdd3b10b26b5350bb0 / 5caf1aa881be0f05f343a5e71319b6e8c31bf63f60850221a7ac1e46b19d611a14ce99fe5fc488c292605a68529c58a741df5705408475625a9630c1a16a85bd / dff2e6ec21413f408c82c9ca2e4cf1110ef650621acb5ecbf2b6b0af0ee0765c059ec3d370e94236ddbae5dfdea4b294fa65ccac9ee5f2bcafb28e50bf06024e / $CDNENCFINISH_ADV2 / .ends asymmetric_delay</Text> / </Model> / <Model Name="d_lm74700" Kind="CKT"> / <Text>*$ / .subckt D_LM74700 1 2 / $CDNENCSTART_ADV2 / 17f62b1fb318c25603aeb85644ae98a5d179ef807807791f6459efacb9d7ffc37a831b146dc0f06bb1ef275619162e6d8f7ad0dc708bf15ae1a1d5bd0ae623b2 / 7239895c878ea5d29926b71112860160ba4a2336c155842202ef4231ea29571c6165ae46f7df2f50aa28a839a9663dcf612ed07829bc9d7912fd290065bfc094 / 8433654e80248e9d0ce1379054d5321eb70c4285467156eeef951a190d9667302310153a23532af982540dd23c06ecb988541f163696fafdd3b10b26b5350bb0 / 668bb57fed292f38dfe900dae3d9d39eb70c4285467156eeef951a190d9667302310153a23532af982540dd23c06ecb988541f163696fafdd3b10b26b5350bb0 / c5fbdf4d708c921f471a030d6f3863a6c31bf63f60850221a7ac1e46b19d611a14ce99fe5fc488c292605a68529c58a741df5705408475625a9630c1a16a85bd / 17a31ffe77583c5ec02c31b30a3bab0bb70c4285467156eeef951a190d9667302310153a23532af982540dd23c06ecb988541f163696fafdd3b10b26b5350bb0 / 759c0bf980ab28fb6d3556ab694ef44c13f044dd88b365416669eca870fc805139d209865d0986fb5b0452014bc0b4dac80c2d1a515d943de0c2abd10398d348 / $CDNENCFINISH_ADV2 / .ends D_LM74700</Text> / </Model> / <Model Name="lm74502_top_s6" Kind="CKT"> / <Text>.subckt LM74502_TOP_S6 1 2 3 4 / S_S6         3 4 1 2 _S6 / RS_S6         1 2 1G / .MODEL         _S6 VSWITCH Roff=1e6 Ron=0.1 Voff=0.2 Von=0.8 / .ends LM74502_TOP_S6</Text> / </Model> / <Model Name="lm74502_top_s10" Kind="CKT"> / <Text>.subckt LM74502_TOP_S10 1 2 3 4 / S_S10         3 4 1 2 _S10 / RS_S10         1 2 1G / .MODEL         _S10 VSWITCH Roff=1e8 Ron=1m Voff=0.2 Von=0.8 / .ends LM74502_TOP_S10</Text> / </Model> / <Model Name="lm74502_top_s8" Kind="CKT"> / <Text>.subckt LM74502_TOP_S8 1 2 3 4 / S_S8         3 4 1 2 _S8 / RS_S8         1 2 1G / .MODEL         _S8 VSWITCH Roff=1e12 Ron=1e6 Voff=0.2 Von=0.8 / .ends LM74502_TOP_S8</Text> / </Model> / <Model Name="lm74502_top_s14" Kind="CKT"> / <Text>.subckt LM74502_TOP_S14 1 2 3 4 / S_S14         3 4 1 2 _S14 / RS_S14         1 2 1G / .MODEL         _S14 VSWITCH Roff=1e8 Ron=4e6 Voff=0.2 Von=0.8 / .ends LM74502_TOP_S14</Text> / </Model> / <Model Name="lm74502_top_s7" Kind="CKT"> / <Text>.subckt LM74502_TOP_S7 1 2 3 4 / S_S7         3 4 1 2 _S7 / RS_S7         1 2 1G / .MODEL         _S7 VSWITCH Roff=2.56e6 Ron=0.1 Voff=0.2 Von=0.8 / .ends LM74502_TOP_S7</Text> / </Model> / <Model Name="lm74502_top" Kind="CKT"> / <Text>* source LM74502-Q1_TRANS / .SUBCKT LM74502_TOP EN GATE GND NC OV SOURCE SRC VCAP / X_U848         EN_SYS DISCHG EN_DISCHG AND2_BASIC_GEN PARAMS: VDD=1 VSS=0 / +  VTHRESH=500E-3 / X_U9         RTN N01290 D_LM74700 / C_C30         0 POR_L1  1n / X_S10    POR_L1 0 RTN GND LM74502_TOP_S10 / C_C33         0 N17348560  1n / R_R19         N17310976 N00259  0.5 TC=0,0 / R_R38         EN_OK N17348560  1 / V_V5         N07506 0 0.8 / E_E7         N16769384 0 VCAP GND 1 / E_ABM1         N17342995 0 VALUE {  V(VCAP) / + -V(SOURCE_INT)   } / V_V1         V2V 0 0.64 / C_C34         0 N17353963 C_C34 1n / .model        C_C34 CAP C=1  TC1=0 TC2=0 VC1=0 VC2=0 / C_C31         0 VCP  1n / R_R44         RX VCAPH_INT  62.5k / X_U836         VCP N07512 N07506 DISCHG COMPHYS_BASIC_GEN PARAMS: VDD=1 VSS=0 / +  VTHRESH=0.5 / V_V6         N07512 0 12.4 / G_ABMII4         N17347506 SOURCE_INT VALUE { if( V(EN_DISCHG)&lt;0.5,0u,5u)    } / X_S6    EN_CHG 0 N17347404 VCAP LM74502_TOP_S6 / X_U872         N17353864 UVLO_OK_DELY N17353883 AND2_BASIC_GEN PARAMS: VDD=1 / +  VSS=0 VTHRESH=500E-3 / X_U3         N00259 SOURCE_INT2 D_LM74700 / X_U867         EN_DELY EN_SYS N17353833 AND2_BASIC_GEN PARAMS: VDD=1 VSS=0 / +  VTHRESH=500E-3 / X_S8    EN_SYSB 0 VCAP SOURCE_INT LM74502_TOP_S8 / X_U863         N17348560 EN_DELY ASYMMETRIC_DELAY PARAMS: RISING_EDGE_DELAY=75u / +  VTHRESH=0.5 FALLING_EDGE_DELAY=20u VDD=1 VSS=0 / V_V17         N17218878 0 0.1 / V_V19         N17354154 0 1.23 / X_U868         N17353833 CP_POR N17353864 AND2_BASIC_GEN PARAMS: VDD=1 VSS=0 / +  VTHRESH=500E-3 / C_C32         0 VCAPH_INT  1n / V_V3         N14077 0 1.1 / G_ABMII6         GATE N17341066 VALUE { IF(V(EN_DRVB)&gt;0.5, 2370m,0)    } / X_U835         VCP N23305 N171654380 CP_POR COMPHYS_BASIC_GEN PARAMS: VDD=1 / +  VSS=0 VTHRESH=0.5 / V_V4         N14253 0 3.9 / X_S14    EN_OK 0 EN RTN LM74502_TOP_S14 / R_R36         N17342995 VCP  1 / C_C7         N01074 GND  0.001n IC=0 TC=0,0 / E_E6         EN_INT 0 EN RTN 1 / X_U861         N17341066 GATE D_LM74700 / G_ABM2I2         N00299 RTN VALUE { IF(V(EN_DRV)&gt;0.5, 61u, / +  if(V(POR)&gt;0.5,0.9u,0))    } / R_R43         N17354116 N17363022  1 / X_U849         EN_SYS EN_SYSB INV_BASIC_GEN PARAMS: VDD=1 VSS=0 VTHRESH=500E-3 / R_R37         N16769384 VCAPH_INT  1 / X_U5         GATE RX D_LM74700 / X_U856         SOURCE_INT N17218888 N17218878 N17272108 COMPHYS_BASIC_GEN / +  PARAMS: VDD=1 VSS=0 VTHRESH=0.5 / G_ABMII5         RX GATE VALUE { IF(V(EN_DRV)&gt;0.5, 11m,0)    } / X_S7    EN_DISCHG GND VCAP N17347506 LM74502_TOP_S7 / C_C35         0 N17363022 C_C35 1n / .model        C_C35 CAP C=1  TC1=0 TC2=0 VC1=0 VC2=0 / X_U842         EN_INT V2V N09341 EN_OK COMPHYS_BASIC_GEN PARAMS: VDD=1 VSS=0 / +  VTHRESH=0.5 / V_V22         N173539223 0 0.9 / V_V21         N17353990 0 1.24 / G_ABMII3         0 N17347404 VALUE { if( V(EN_CHG)&lt;0.5,0u,300u)    } / X_U875         OV_DELY N17353898 INV_BASIC_GEN PARAMS: VDD=1 VSS=0 / +  VTHRESH=500E-3 / V_V7         N171654380 0 1.1 / R_R35         N17272108 POR_L1  10 / X_U847         DISCHG CHG INV_BASIC_GEN PARAMS: VDD=1 VSS=0 VTHRESH=500E-3 / E_E5         SOURCE_INT 0 N00299 RTN 1 / X_U877         N17363022 OV_DELY ASYMMETRIC_DELAY PARAMS: RISING_EDGE_DELAY=2u / +  VTHRESH=0.5 FALLING_EDGE_DELAY=7u VDD=1 VSS=0 / X_U844         EN_OK POR EN_SYS AND2_BASIC_GEN PARAMS: VDD=1 VSS=0 / +  VTHRESH=500E-3 / V_V8         N01138 GND 0.6Vdc / V_V2         N09341 0 0.9 / V_V20         N173540393 0 1.1 / V_V18         N17218888 0 -1m / R_R40         N17353958 N17353963  1 / X_U876         OV_INT N17354154 N173540393 N17354116 COMPHYS_BASIC_GEN PARAMS: / +  VDD=1 VSS=0 VTHRESH=0.5 / X_U871         N17353963 UVLO_OK_DELY ASYMMETRIC_DELAY PARAMS: / +  RISING_EDGE_DELAY=75u VTHRESH=0.5 FALLING_EDGE_DELAY=2u VDD=1 VSS=0 / R_R15         N01074 RTN  10 TC=0,0 / V_V9         N23305 0 6.5 / E_E9         SOURCE_INT2 0 SOURCE GND 1 / R_R29         N01138 N01290  0.5 TC=0,0 / X_U873         EN_DRV EN_DRVB INV_BASIC_GEN PARAMS: VDD=1 VSS=0 VTHRESH=500E-3 / X_U846         EN_SYS CHG EN_CHG AND2_BASIC_GEN PARAMS: VDD=1 VSS=0 / +  VTHRESH=500E-3 / X_U843         SOURCE_INT N14253 N14077 POR COMPHYS_BASIC_GEN PARAMS: VDD=1 / +  VSS=0 VTHRESH=0.5 / X_U874         N17353883 N17353898 EN_DRV AND2_BASIC_GEN PARAMS: VDD=1 VSS=0 / +  VTHRESH=500E-3 / V_V14         RTN N17310976 0.6Vdc / X_U869         EN_INT N17353990 N173539223 N17353958 COMPHYS_BASIC_GEN PARAMS: / +  VDD=1 VSS=0 VTHRESH=0.5 / R_R45         OV OV_INT  1 / R_R46         N17341066 SRC  1 / R_R47         SOURCE N00299  1 / .ENDS</Text> / <Dependency>0\asymmetric_delay</Dependency> / <Dependency>1\and2_basic_gen</Dependency> / <Dependency>0\d_lm74700</Dependency> / <Dependency>0\lm74502_top_s6</Dependency> / <Dependency>0\lm74502_top_s10</Dependency> / <Dependency>0\lm74502_top_s8</Dependency> / <Dependency>1\comphys_basic_gen</Dependency> / <Dependency>0\lm74502_top_s14</Dependency> / <Dependency>1\inv_basic_gen</Dependency> / <Dependency>0\lm74502_top_s7</Dependency> / </Model> / <Model Name="spx3819" Kind="CKT"> / <Text>.SUBCKT SPX3819 VIN VOUT GND EN / * PARAMETERS / .PARAM VREF=3.3 / .PARAM VDROP=0.34 / .PARAM ILIM=0.9 / .PARAM ROUT=0.05 / * Enable logic (EN &gt; 1V) / EEN VEN 0 VALUE = { V(EN) &gt; 1 } / * Regulator core (with dropout) / EREG VREG 0 VALUE = { V(VEN)*LIMIT(V(VIN)-VDROP, 0, VREF) } / * Output resistance / Rout VREG VOUT {ROUT} / * Current sense / Rsense VOUT VSENSE 0.01 / * Current limit clamp / GCLAMP VOUT 0 VALUE = { / IF(I(Rsense) &gt; ILIM, -(I(Rsense)-ILIM)*5, 0) / } / * Ground reference / RGND GND 0 1m / .ENDS SPX3819</Text> / </Model> / <Model Name="fb_220_adv" Kind="CKT"> / <Text>.SUBCKT FB_220_ADV 1 2 / Rdc 1 2 0.045 / * low freq inductive / L1 1 3 50n / R1 3 2 1 / * high freq loss / R2 1 2 200 / Cpar 1 2 2p / .ends FB_220_ADV</Text> / </Model> / <Model Name="mmbt3904" Kind="CKT"> / <Text>* SPICE model NPN bipolar transistor ***MMBT3904*** / * Use the symbol file ***mmbt3904.asy*** / * / * (c) Diotec Semiconductor AG / * www.diotec.com / * 2024-10-15 / * / ********************************************************* / * This model is for simulation purposes only. It does   * / * not replace reviewing of the data sheet nor real life * / * testing of the part inside the application.           * / ********************************************************* / * / .subckt MMBT3904 C  B  E  params: Vceo=40 Vcbo=60 Vebo=6 Ic=200m hfe=300 Ices=100n Vbe=700m ft=300Meg Ccbo=4p Cebo=8p Rc=1 Rb=.1 Re=.1 Eg=1.11 Xti=3 / * Above values are an example for the ***MMBT3904***. Using the / * above symbol file allows for direct insertion of other values / * according to these data sheet parameters: / * / * Vceo    	Collector Emitter voltage, Base open / * Vcbo		Collector Base voltage, Emitter open / * Vebo    	Emitter Base voltage, Collector open / * Ic		DC Collector current / * hfe		Max DC current gain / * Ices		Collector Emitter cut-off current / * Vbe		Min Base Emitter voltage / * ft		Gain bandwidth product / * Ccbo		Typ. Collector Base capacitance / * Cebo		Typ. Emitter Base capacitance / * Rc/Rb/Re	Fixed values / * / * Activation energy: Eg=1.11 for Si (npn) transistor / * Sat.-current temp. exp: Xti=3 for Si (npn) transistor / Q  C B E  Transistor / .model Transistor NPN(Is={Ices/2} Bf={hfe} Bvcbo={Vcbo} Bvbe={-Vebo} Vceo={Vceo} Vje={Vbe} Tf={1/(2*pi*ft)} Eg={Eg} Xti={Xti} Icrating={Ic} Cjc={Ccbo*2} Cje={Cebo*2} Rc={Rc} Rb={Rb} Re={Re} mfg=Diotec) / .ends</Text> / </Model> / <Model Name="bat54c" Kind="CKT"> / <Text>* SPICE model small signal diode ***BAT54C*** / * Use with symbol file ***bat54c.asy*** / * / * (c) Diotec Semiconductor AG / * www.diotec.com / * 2017-12-05 / * / ********************************************************* / * This model is for simulation purposes only. It does   * / * not replace reviewing of the data sheet nor real life * / * testing of the part inside the application.           * / ********************************************************* / * / .subckt BAT54C A1 A2 K  params: Vrrm=30 Vrsm=30 Ir=2u Irsm=2u Vf=1.0 Ifav=0.1 Rs=0.125 trr=5n Cj=10p Eg=0.69 Xti=2 / * Above values are an example for the ***BAT54C***. Using the / * above symbol file allows for direct insertion of other values / * according to these data sheet parameters: / * / * Vrrm    	Repetitive peak reverse voltage / * Ir		Leakage current / * Vrsm    	Surge peak reverse voltage / Reverse avalanche breakdown voltage / * Irsm		Defined at avalanche diodes, otherwise set Irsm = Ir / * Vf		Forward voltage / * Ifav		Test current for Vf, usually equal to average forward rectified current / * trr		Reverse recovery time; for Schottky, set trr=5n / * Cj		Junction capacitance at 0V / * / * Activation energy: Eg=1.11 for Si (pn) rectifier, Eg=.69 for Schottky (metal barrier) rectifier / * Series resistance: Rs=(Vf@3*Ifav - Vf@Ifav)/(3*Ifav - Ifav) from data sheet curve / * Sat.-current temp. exp: Xti=3 for Si (pn) rectifier, Xti=2 for Schottky (metal barrier) rectifier / D1 A1 K Diode / D2 A2 K Diode / .model Diode D(Is={Ir/20} Bv={Vrsm*1.05} Ibv={Ir} Vpk={Vrrm} N={.8*Vf/25m/(ln(Ifav)-ln(Ir/20))} Rs={Rs} Eg={Eg} Xti={Xti} Iave={Ifav} Cjo={Cj} M=.33 Tt={trr} Vp=.5 mfg=Diotec) / .ends</Text> / </Model> / <Model Name="dallasamp_outputcir_iscvlimit_ht4" Kind="CKT"> / <Text>.SUBCKT DallasAmp_OutputCir_IscVlimit_HT4 A B VCC VEE PARAMS: / +RIsc 		 = { 100m } / +IscVsVsupply_X1 = { 3.0 } / +IscVsVsupply_Y1 = { 75m } / +IscVsVsupply_X2 = { 5.0 } / +IscVsVsupply_Y2 = { 100m } / .PARAM IscVsVsupply_SLOPE = / + { ( IscVsVsupply_Y2 - IscVsVsupply_Y1 ) / ( IscVsVsupply_X2 - IscVsVsupply_X1 ) } / .PARAM IscVsVsupply_INTCP = / + { IscVsVsupply_Y1 - IscVsVsupply_SLOPE * IscVsVsupply_X1 } / EIscVsVsupply IscVsVsupply 0 VALUE = / + { IscVsVsupply_SLOPE * V(VCC,VEE) + IscVsVsupply_INTCP  } / E1 A B VALUE = { V(IscVsVsupply) * RIsc } / .ENDS</Text> / </Model> / <Model Name="dallasamp_outputcir_isourcevlimit_ht4" Kind="CKT"> / <Text>.SUBCKT DallasAmp_OutputCir_IsourceVlimit_HT4 A B VCC VEE / X1 A B VCC VEE DallasAmp_OutputCir_IscVlimit_HT4 PARAMS: / +RIsc 		 = { 100m } / +IscVsVsupply_X1 = { 4.0 } / +IscVsVsupply_Y1 = { ABS(100m) } / +IscVsVsupply_X2 = { 6.0 } / +IscVsVsupply_Y2 = { ABS(100m) } / .ENDS</Text> / <Dependency>0\dallasamp_outputcir_iscvlimit_ht4</Dependency> / </Model> / <Model Name="outputcir_iscdiodeideal" Kind="CKT"> / <Text>.SUBCKT OutputCir_IscDiodeIdeal NEG POS PARAMS: / + IS = 1E-14 / + N  = 50m / G1 POS NEG_INT VALUE = { IF ( V(POS,NEG_INT) &lt;= 0, IS, IS * ( EXP ( V(POS,NEG_INT)/25m / + * 1/N)-0 ))} / V1 NEG_INT NEG {-N*0.8} / .ENDS</Text> / </Model> / <Model Name="dallasamp_outputcir_vohvol_ht4" Kind="CKT"> / <Text>.SUBCKT DallasAmp_OutputCir_VOHVOL_HT4 A B C  PARAMS: / + VSUPPLYREF    = {2.5} / + VOUTvsIOUT_X1 = { 0 } / + VOUTvsIOUT_Y1 = { 2.4 } / + VOUTvsIOUT_X2 = { 100m } / + VOUTvsIOUT_Y2 = { 2.1 } / .PARAM VDROPvsIOUT_X1 = { VOUTvsIOUT_X1 } / .PARAM VDROPvsIOUT_Y1 = { ABS(VSUPPLYREF-VOUTvsIOUT_Y1) } / .PARAM VDROPvsIOUT_X2 = { VOUTvsIOUT_X2 } / .PARAM VDROPvsIOUT_Y2 = { ABS(VSUPPLYREF-VOUTvsIOUT_Y2) } / .PARAM VDROPvsIOUT_SLOPE = / + { ( VDROPvsIOUT_Y2 - VDROPvsIOUT_Y1 ) / ( VDROPvsIOUT_X2 - VDROPvsIOUT_X1 ) } / .PARAM VDROPvsIOUT_INTCP = / + { VDROPvsIOUT_Y1 - VDROPvsIOUT_SLOPE * VDROPvsIOUT_X1 } / EVDROPvsIOUT VDROPvsIOUT 0 VALUE = / + { VDROPvsIOUT_SLOPE * V(C) + VDROPvsIOUT_INTCP  } / E1 A B VALUE = { V(VDROPvsIOUT) } / .ENDS</Text> / </Model> / <Model Name="dallasamp_outputcir_voh_ht4" Kind="CKT"> / <Text>.SUBCKT DallasAmp_OutputCir_VOH_HT4 A B C / X1 A B C DallasAmp_OutputCir_VOHVOL_HT4 PARAMS: / + VSUPPLYREF    = {6} / + VOUTvsIOUT_X1 = { ABS(0) } / + VOUTvsIOUT_Y1 = { 5.7 } / + VOUTvsIOUT_X2 = { ABS(100m) } / + VOUTvsIOUT_Y2 = { 5.7 } / .ENDS</Text> / <Dependency>0\dallasamp_outputcir_vohvol_ht4</Dependency> / </Model> / <Model Name="dallasamp_outputcir_isinkvlimit_ht4" Kind="CKT"> / <Text>.SUBCKT DallasAmp_OutputCir_IsinkVlimit_HT4 A B VCC VEE / X1 A B VCC VEE DallasAmp_OutputCir_IscVlimit_HT4 PARAMS: / +RIsc 		 = { 100m } / +IscVsVsupply_X1 = { 4.0 } / +IscVsVsupply_Y1 = { ABS(-100m) } / +IscVsVsupply_X2 = { 6.0 } / +IscVsVsupply_Y2 = { ABS(-100m) } / .ENDS</Text> / <Dependency>0\dallasamp_outputcir_iscvlimit_ht4</Dependency> / </Model> / <Model Name="dallasamp_outputcir_vol_ht4" Kind="CKT"> / <Text>.SUBCKT DallasAmp_OutputCir_VOL_HT4 A B C / X1 A B C DallasAmp_OutputCir_VOHVOL_HT4 PARAMS: / + VSUPPLYREF    = {0} / + VOUTvsIOUT_X1 = { ABS(0) } / + VOUTvsIOUT_Y1 = { 0.3 } / + VOUTvsIOUT_X2 = { ABS(-100m) } / + VOUTvsIOUT_Y2 = { 0.3 } / .ENDS</Text> / <Dependency>0\dallasamp_outputcir_vohvol_ht4</Dependency> / </Model> / <Model Name="dallasamp_outputcir_rout_ht4" Kind="CKT"> / <Text>.SUBCKT DallasAmp_OutputCir_Rout_HT4 B A VIMON / .PARAM Ro_Iout_0A = 100 / .PARAM RIsc = 100m / .PARAM Isc = 100m / .PARAM Islope = { 1/100 * Isc } / G1 A B VALUE = { V(A,B) * 1 / ( (Ro_Iout_0A - RIsc) * Islope / ( Islope + ABS(V(VIMON)) ) )   } / .ENDS</Text> / </Model> / <Model Name="dallasamp_diodeideal_ht4" Kind="CKT"> / <Text>.SUBCKT DallasAmp_DiodeIdeal_HT4 NEG POS / G1 POS NEG VALUE = { IF ( V(POS,NEG) &lt;= 0 , 0, V(POS,NEG)*0.01G ) } / R0 POS NEG 1000G / .ENDS</Text> / </Model> / <Model Name="dlsinv" Kind="CKT"> / <Text>.SUBCKT DLSINV 1 2 VDD_OLD VSS_OLD VDD_NEW VSS_NEW / E1 3 0 VALUE = { IF( V(1) &gt; (V(VDD_OLD)+V(VSS_OLD))/2, V(VSS_NEW), V(VDD_NEW) ) } / R1 3 2 1 / C1 2 0 1p / .ENDS</Text> / </Model> / <Model Name="dallasamp_outputcir_iload_ht4" Kind="CKT"> / <Text>.SUBCKT DallasAmp_OutputCir_ILOAD_HT4  VDD VSS VIMON PD / X1 PD PDINV VDD VSS LOGIC1 0 DLSINV / VLOGIC1 LOGIC1 0 1 / G1 VDD 0 VALUE = {IF(V(VIMON) &gt;= 0, V(VIMON)*( 1-V(PDINV) ), 0)} / G2 VSS 0 VALUE = {IF(V(VIMON)  &lt; 0, V(VIMON)*( 1-V(PDINV) ), 0)} / .ENDS</Text> / <Dependency>0\dlsinv</Dependency> / </Model> / <Model Name="analog_buffer" Kind="CKT"> / <Text>.subckt ANALOG_BUFFER VOUT VIN / R0 VIN 0 1e9 / R1 VOUT 0 1e9 / E0 VOUT 0 VIN 0 1 / .ends ANALOG_BUFFER</Text> / </Model> / <Model Name="dls" Kind="CKT"> / <Text>.SUBCKT DLS 1 2 VDD_OLD VSS_OLD VDD_NEW VSS_NEW / E1 3 0 VALUE = { IF( V(1) &lt; (V(VDD_OLD)+V(VSS_OLD))/2, V(VSS_NEW), V(VDD_NEW) ) } / R1 3 2 1 / C1 2 0 1p / .ENDS</Text> / </Model> / <Model Name="dallasamp_outputcir_recoveryassist_ht4" Kind="CKT"> / <Text>.SUBCKT DallasAmp_OutputCir_RecoveryAssist_HT4  VINP VINM IOUTP IOUTM VCC VEE RecoverySignal / X1 RecoverySignal RS VCC VEE LOGIC1 0 DLS / VLOGIC1 LOGIC1 0 1 / G1 IOUTP IOUTM VALUE = { LIMIT ( 1m * V(VINP,VINM) *  V(RS) , -100m, 100m ) } / .ENDS</Text> / <Dependency>0\dls</Dependency> / </Model> / <Model Name="hpa_or2" Kind="CKT"> / <Text>.SUBCKT HPA_OR2 1 2 3 VDD VSS / E1 4 0 VALUE = { IF( ((V(1)&lt; (V(VDD)+V(VSS))/2 ) &amp; (V(2)&lt; (V(VDD)+V(VSS))/2 )), V(VSS), V(VDD) ) } / R1 4 3 1 / C1 3 0 1e-12 / .ENDS</Text> / </Model> / <Model Name="hpa_comp_ideal" Kind="CKT"> / <Text>.SUBCKT HPA_COMP_IDEAL INP INN OUT VDD VSS / E1 OUT 0 VALUE = { IF( (V(INP) &gt; V(INN)), V(VDD), V(VSS) ) } / .ENDS</Text> / </Model> / <Model Name="dallasamp_outputcir_ht4" Kind="CKT"> / <Text>.subckt DALLASAMP_OUTPUTCIR_HT4 PD VCC VCCMAIN VEE VEEMAIN VIN VOUT / XI21 NET75 NET76 VCC VEE DallasAmp_OutputCir_IsourceVlimit_HT4 / XI20 NET79 NET092 VCC VEE DallasAmp_OutputCir_IsinkVlimit_HT4 / XI17 VOL VEE VIMONINV DallasAmp_OutputCir_VOL_HT4 / XI16 VCC VOH VIMON DallasAmp_OutputCir_VOH_HT4 / *DISOURCE NET092 NET75 OutputCir_Isc_DIDEAL / *DISINK NET76 NET79 OutputCir_Isc_DIDEAL / XI2500 NET75 NET092 OutputCir_IscDiodeIdeal PARAMS: IS=10e-15 N=50e-3 / XI2300 NET79 NET76 OutputCir_IscDiodeIdeal PARAMS: IS=10e-15 N=50e-3 / XI14 NET070 NET15 DallasAmp_DiodeIdeal_HT4 / XI15 NET068 VOL DallasAmp_DiodeIdeal_HT4 / XI0 VCCMAIN VEEMAIN VIMON PD DallasAmp_OutputCir_ILOAD_HT4 / XI1 NET53 NET22 VIMON DallasAmp_OutputCir_Rout_HT4 / XI6 NET22 NET0100 0 NET043 VCC VEE RECOVERYSIGNAL DallasAmp_OutputCir_RecoveryAssist_HT4 / XAHDLI43 NET055 NET054 RECOVERYSIGNAL VCC VEE HPA_OR2 / XAHDLI41 VOUT NET067 NET055 VCC VEE HPA_COMP_IDEAL / XAHDLI42 NET059 VOUT NET054 VCC VEE HPA_COMP_IDEAL / HVIMONINV VIMONINV 0 VCURSINKDETECT  1 / HVIMON VIMON 0 VCURSOURCEDETECT  1 / RVIMONINV VIMONINV 0 1e9 / RVIMON VIMON 0 1e9 / RISC NET092 NET15 100e-3 / ROUTMINOR NET0100 NET17 10 / XI11 NET76 NET15 ANALOG_BUFFER / XI2 NET22 VIN ANALOG_BUFFER / VPROBE3 NET070 VOH 0 / VPROBE2 NET043 NET0100 0 / VTRIGGERVOL NET059 VOL 10e-3 / VTRIGGERVOH VOH NET067 10e-3 / VPROBE4 NET068 NET15 0 / VCURSOURCEDETECT NET15 NET34 0 / VCURSINKDETECT VOUT NET34 0 / VPROBE1 NET53 NET17 0 / LOUT NET17 NET092 500e-12 / CP NET17 0 10e-15 / COUT NET22 NET0100 1e-15 / .ends DALLASAMP_OUTPUTCIR_HT4</Text> / <Dependency>0\dallasamp_outputcir_isourcevlimit_ht4</Dependency> /